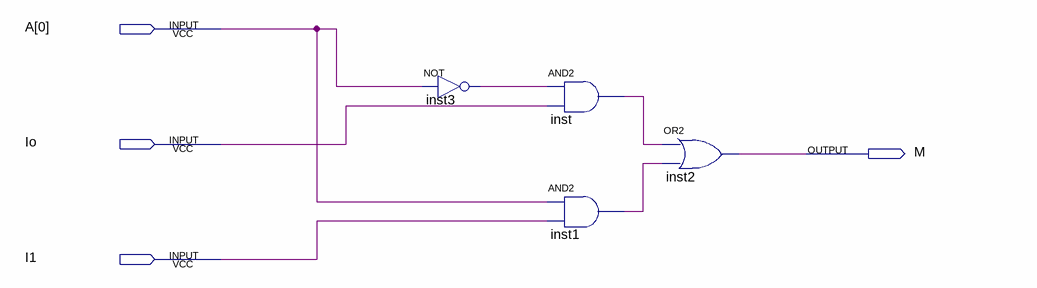
[diagram p0: schematic sheet]
// Quartus schematic Mux.bdf as structural Verilog: 4 symbols, 4 pins
module Mux (
  input  [0:0] A,
  input  Io,
  input  I1,
  output M
);

  wire inst1_out, inst3_out, inst_out;

  not inst3 (inst3_out, A[0]);
  and inst (inst_out, inst3_out, Io);
  and inst1 (inst1_out, A[0], I1);
  or inst2 (M, inst_out, inst1_out);
endmodule
